# Altium schematic sheet PS2.SchDoc
size A4
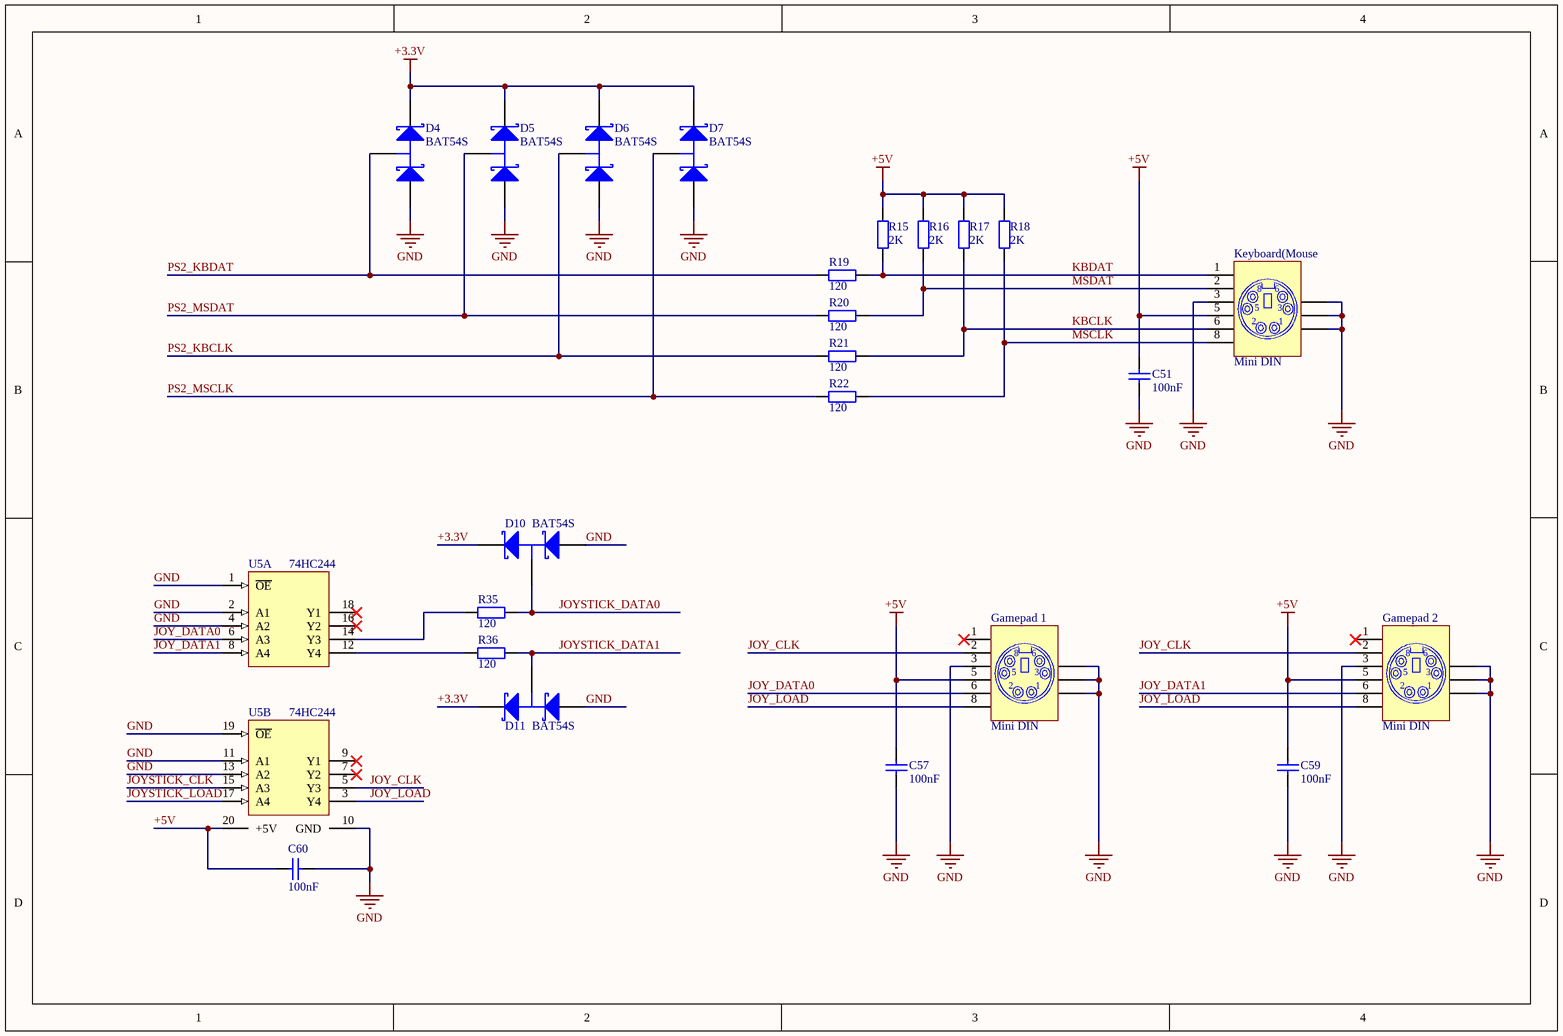
[diagram p0: PS2.SchDoc]

## Parts
C51  value 100nF  [6-0805_n]  (hidden comment: Cap)
C57  value 100nF  [6-0805_n]  (hidden comment: Cap)
C59  value 100nF  [6-0805_n]  (hidden comment: Cap)
C60  value 100nF  [6-0805_n]  (hidden comment: Cap)
D4  BAT54S  [SOT23_N]
D5  BAT54S  [SOT23_N]
D6  BAT54S  [SOT23_N]
D7  BAT54S  [SOT23_N]
D10  BAT54S  [SOT23_N]
D11  BAT54S  [SOT23_N]
Gamepad_1  Mini DIN  [Mini DIN PS/2]
Gamepad_2  Mini DIN  [Mini DIN PS/2]
Keyboard(Mouse  Mini DIN  [Mini DIN PS/2]
R15  value 2K  [6-0805_N]  (hidden comment: Res2)
R16  value 2K  [6-0805_N]  (hidden comment: Res2)
R17  value 2K  [6-0805_N]  (hidden comment: Res2)
R18  value 2K  [6-0805_N]  (hidden comment: Res2)
R19  value 120  [6-0805_N]  (hidden comment: Res2)
R20  value 120  [6-0805_N]  (hidden comment: Res2)
R21  value 120  [6-0805_N]  (hidden comment: Res2)
R22  value 120  [6-0805_N]  (hidden comment: Res2)
R35  value 120  [6-0805_N]  (hidden comment: Res2)
R36  value 120  [6-0805_N]  (hidden comment: Res2)
U5  74HC244  [948E-02_N]  (parts A,B of 2)

## Nets
+3.3V: D4.2(K) D5.2(K) D6.2(K) D7.2(K) D10.2(K) D11.2(K)
+5V: C51.2 C57.2 C59.2 C60.2 Gamepad_1.5 Gamepad_2.5 Keyboard(Mouse.5 R15.1 R16.1 R17.1 R18.1 U5.20(VDD)
GND: C51.1 C57.1 C59.1 C60.1 D4.1(A) D5.1(A) D6.1(A) D7.1(A) D10.1(A) D11.1(A) Gamepad_1.3 Gamepad_1.MH1 Gamepad_1.MH2 Gamepad_1.MH3 Gamepad_2.3 Gamepad_2.MH1 Gamepad_2.MH2 Gamepad_2.MH3 Keyboard(Mouse.3 Keyboard(Mouse.MH1 Keyboard(Mouse.MH2 Keyboard(Mouse.MH3 U5.1(~{OE}) U5.2(A1) U5.4(A2) U5.10(GND) U5.11(A1) U5.13(A2) U5.19(~{OE})
JOY_CLK: Gamepad_1.2 Gamepad_2.2 U5.5(Y3)
JOY_DATA0: Gamepad_1.6 U5.6(A3)
JOY_DATA1: Gamepad_2.6 U5.8(A4)
JOY_LOAD: Gamepad_1.8 Gamepad_2.8 U5.3(Y4)
JOYSTICK_CLK: U5.15(A3)
JOYSTICK_DATA0: D10.3(C) R35.1
JOYSTICK_DATA1: D11.3(C) R36.1
JOYSTICK_LOAD: U5.17(A4)
KBCLK: Keyboard(Mouse.6 R17.2 R21.2
KBDAT: Keyboard(Mouse.1 R15.2 R19.2
MSCLK: Keyboard(Mouse.8 R18.2 R22.2
MSDAT: Keyboard(Mouse.2 R16.2 R20.2
PS2_KBCLK: D6.3(C) R21.1
PS2_KBDAT: D4.3(C) R19.1
PS2_MSCLK: D7.3(C) R22.1
PS2_MSDAT: D5.3(C) R20.1
NetR35_2: R35.2 U5.14(Y3)
NetR36_2: R36.2 U5.12(Y4)

Not connected (* = marked no-connect by the designer): Gamepad_1 1*; Gamepad_2 1*; U5 7(Y2)* 9(Y1)* 16(Y2)* 18(Y1)*

## Notes on the sheet
- Title
- Size:
- Date:
- A4
- Number:
- Time:
- Revision:
- Sheet
- of
- File:

## Library data of the parts
C51 C57 C59 C60 = Cap: Capacitor; Published: 8-Jun-2000; LatestRevisionDate: 17-Jul-2002; LatestRevisionNote: Re-released for DXP Platform.; PackageReference: RAD-0.3; Publisher: Altium Limited; PackageDescription: Radial Cap, Thru-Hole; 2 Leads; 0.3 in Pin Spacing
D4-D7 D10 D11 = BAT54S: Schottky Barrier Double Diode; Published: 17-Sep-2003; LatestRevisionDate: 12-Dec-2006; LatestRevisionNote: IPC-7351 Footprint Added.; DatasheetVersion: 4-Mar-2002; PackageVersion: May-1999; PackageReference: SOT23; Publisher: Altium Limited; PackageDescription: 3-Pin SOT-23 Package 0.95 mm Pitch, 2.3 mm Lead Span; ComponentLink1Description: Manufacturer Link; ComponentLink1URL: http://www.semiconductors.philips.com/; ComponentLink2Description: Datasheet; ComponentLink2URL: http://www.semiconductors.philips.com/acrobat/datasheets/BAT54_SERIES_4.pdf
Gamepad_1 Gamepad_2 Keyboard(Mouse = Mini DIN PS/2
R15-R22 R35 R36 = Res2: Resistor; Published: 8-Jun-2000; LatestRevisionDate: 17-Jul-2002; LatestRevisionNote: Re-released for DXP Platform.; PackageReference: AXIAL-0.4; Publisher: Altium Limited; PackageDescription: Axial Device, Thru-Hole; 2 Leads; 0.4 in Pin Spacing
U5 = MC74HC244ADW: Octal 3-State Non-Inverting Buffer/Line Driver/Line Receiver; Published: 15-Apr-2002; LatestRevisionDate: 13-Apr-2006; LatestRevisionNote: IPC-7351 Footprint Added.; DatasheetVersion: Mar-2000; PackageReference: 751D-05; Publisher: Altium Limited; PackageDescription: 20-Pin Small Outline Integrated Circuit 1.27 mm Pitch; ComponentLink1Description: Manufacturer Link; ComponentLink1URL: http://www.onsemi.com/; ComponentLink2Description: Datasheet; ComponentLink2URL: http://www.onsemi.com/pub/Collateral/MC74HC244A-D.PDF